# Altium schematic sheet SoM-Supply.SchDoc
size A3; DocumentNumber: 2; SheetNumber: 2; SheetTotal: 9; PageSetup: Record=PageOptions|CenterHorizontal=True|CenterVertical=True|PrintScale=0.97|XCorrection=1.00|YCorrection=1.00|PrintKind=1|BorderSize=5000000|LeftOffset=0|BottomOffset=0|Orientation=2|PaperLength=2970|PaperWidth=2100|Scale=100|PaperSource=7|PrintQuality=600|MediaType=1|DitherType=10|PaperKind=A4|PrintScaleMode=1
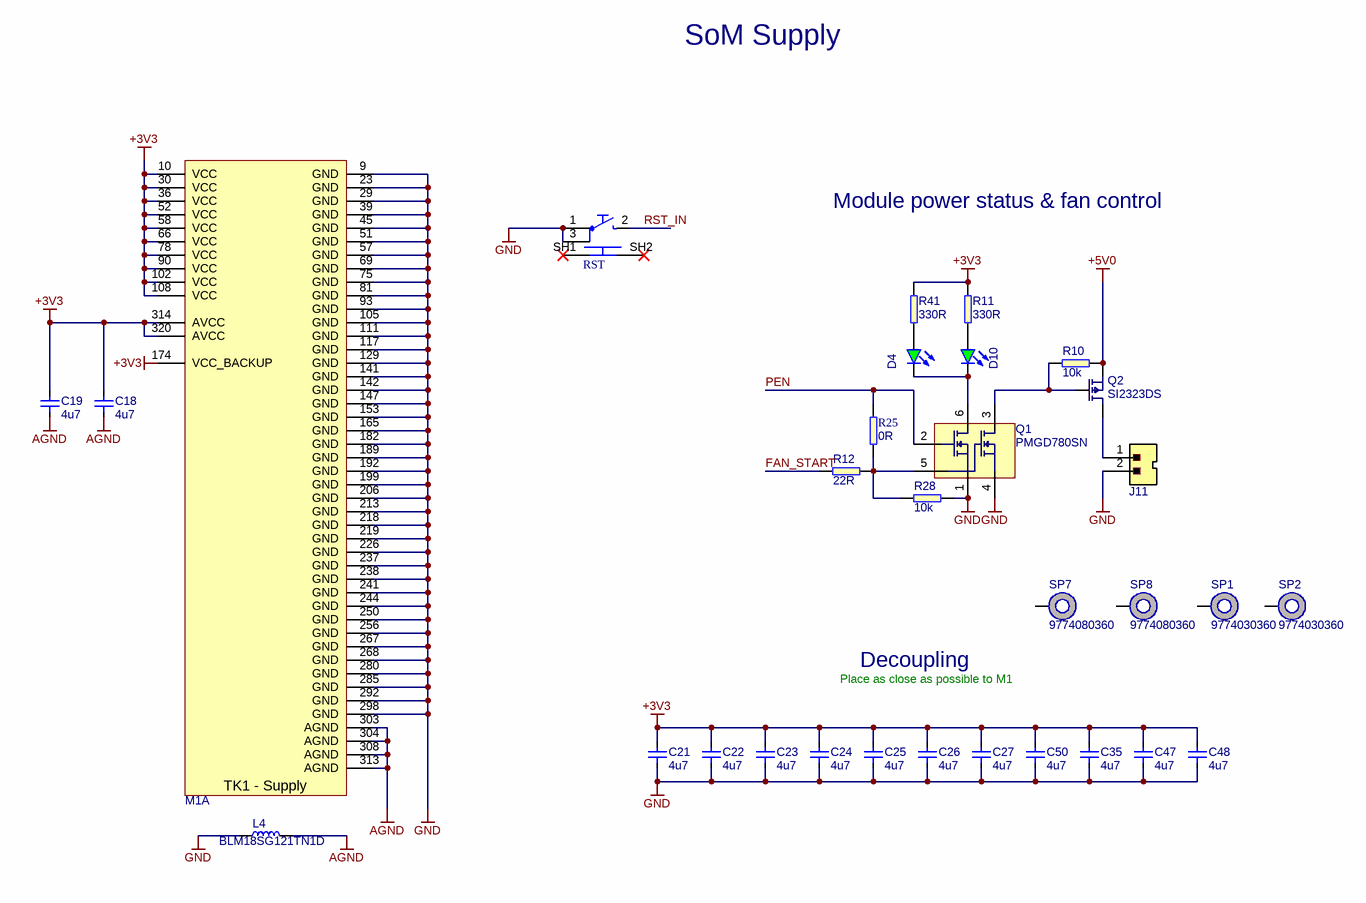
[diagram p0: SoM-Supply.SchDoc]

## Parts
C18  4u7  [0603]
C19  4u7  [0603]
C21  4u7  [0603]
C22  4u7  [0603]
C23  4u7  [0603]
C24  4u7  [0603]
C25  4u7  [0603]
C26  4u7  [0603]
C27  4u7  [0603]
C35  4u7  [0603]
C47  4u7  [0603]
C48  4u7  [0603]
C50  4u7  [0603]
D4  KPT-1608SGC  [LED0603]  (value not drawn)
D10  KPT-1608SGC  [LED0603]  (value not drawn)
J11  MX-22-23-2021  [molex_2223-2021]  (value not drawn)
L4  BLM18SG121TN1D  [0603]
M1  MM70-314-310B1  [Apalis-H]  (value not drawn)  (part A of 25)
Q1  PMGD780SN  [SOT-363]
Q2  SI2323DS  [SOT-23]
R10  10k  [0402]
R11  330R  [0402]
R12  22R  [0402]
R25  0R  [0402]
R28  10k  [0402]
R41  330R  [0402]
RST  TL3340AF160QG  [TL3340AF160QG]  (value not drawn)
SP1  9774030360  [M3-3mm]
SP2  9774030360  [M3-3mm]
SP7  9774080360  [M3-8mm]
SP8  9774080360  [M3-8mm]

## Nets
+3V3: C18.2 C19.2 C21.2 C22.2 C23.2 C24.2 C25.2 C26.2 C27.2 C35.2 C47.2 C48.2 C50.2 M1.10(VCC) M1.30(VCC) M1.36(VCC) M1.52(VCC) M1.58(VCC) M1.66(VCC) M1.78(VCC) M1.90(VCC) M1.102(VCC) M1.108(VCC) M1.174(VCC_BACKUP) M1.314(AVCC) M1.320(AVCC) R11.2 R41.2
+5V0: Q2.2(S) R10.2
AGND: C18.1 C19.1 L4.2 M1.303(AGND) M1.304(AGND) M1.308(AGND) M1.313(AGND)
GND: C21.1 C22.1 C23.1 C24.1 C25.1 C26.1 C27.1 C35.1 C47.1 C48.1 C50.1 J11.2 L4.1 M1.9(GND) M1.23(GND) M1.29(GND) M1.39(GND) M1.45(GND) M1.51(GND) M1.57(GND) M1.69(GND) M1.75(GND) M1.81(GND) M1.93(GND) M1.105(GND) M1.111(GND) M1.117(GND) M1.129(GND) M1.141(GND) M1.142(GND) M1.147(GND) M1.153(GND) M1.165(GND) M1.182(GND) M1.189(GND) M1.192(GND) M1.199(GND) M1.206(GND) M1.213(GND) M1.218(GND) M1.219(GND) M1.226(GND) M1.237(GND) M1.238(GND) M1.241(GND) M1.244(GND) M1.250(GND) M1.256(GND) M1.267(GND) M1.268(GND) M1.280(GND) M1.285(GND) M1.292(GND) M1.298(GND) Q1.1(S1) Q1.4(S2) R28.2 RST.1 RST.3
FAN_START: R12.1
PEN: Q1.2(G1) R25.2
RST_IN: RST.2
NetD4_A: D4.A R41.1
NetD4_K: D4.K D10.K Q1.6(D1)
NetD10_A: D10.A R11.1
NetJ11_1: J11.1 Q2.3(D)
NetQ1_3: Q1.3(D2) Q2.1(G) R10.1
NetQ1_5: Q1.5(G2) R12.2 R25.1 R28.1

Not connected (* = marked no-connect by the designer): RST SH1* SH2*; SP1 1; SP2 1; SP7 1; SP8 1

## Notes on the sheet
- SoM Supply
- Module power status & fan control
- Place as close as possible to M1
- Decoupling
- Title:
- Size:
- Date:
- A3
- Revision:
- Page:
- of
- Antmicro Ltd.
- File:
- www.antmicro.com
- (in symbol Apalis-TK1-H, part A) TK1 - Supply

## Library data of the parts
C18 C19 C21-C27 C35 C47 C48 C50 = C_4u7_0603: MLCC SMT Capacitor 4.7uF 0603; Manufacturer: MULTICOMP; Part Symbol: MC0603X475K6R3CT; Value: 4u7; Part Number: C_4u7_0603; MPN: MC0603X475K6R3CT
D4 D10 = LED_G: LED Green 0603 case; Manufacturer: KINGBRIGHT; Part Number: LED_G; Value: KPT-1608SGC; Part Symbol: KPT-1608SGC; MPN: KPT-1608SGC
J11 = molex_2223-2021: Pinhead connector with key; Manufacturer: Molex; Part Symbol: 022232021 A-6373-02A222; Part Number: molex_2223-2021; Value: MX-22-23-2021; MPN: 022232021 A-6373-02A222
L4 = BLM18SG121TN1D: FERRITE BEAD, 0.025OHM, 3A, 0603; Manufacturer: MURATA; Part Number: BLM18SG121TN1D; Value: BLM18SG121TN1D; Part Symbol: BLM18SG121TN1D; MPN: BLM18SG121TN1D
M1 = Apalis-TK1-H: Toradex Apalis TK1, Horizontal; Manufacturer: JAE Electronics; Part Number: Apalis-TK1-H; Part Symbol: MM70-314-310B1; Value: MM70-314-310B1; MPN: MM70-314-310B1
Q1 = PMGD780SN: 60 V, dual N-channel Trench MOSFET; Manufacturer: NXP; Part Symbol: PMGD780SN,115; Part Number: PMGD780SN; Value: PMGD780SN; MPN: PMGD780SN,115
Q2 = PMOS: pMOS 4.7A 20V; Manufacturer: Vishay; Part Symbol: SI2323DS-T1-E3; Part Number: SI2323DS; Value: SI2323DS; MPN: SI2323DS-T1-E3
R10 R28 = R_10k_0402: RES, 10k, 0402; Manufacturer: MULTICOMP; Part Symbol: MCMR04X1002FTL; Value: 10k; Part Number: R_10k_0402; MPN: MCMR04X1002FTL
R11 R41 = R_330R_0402: RES, 330R, 0402; Manufacturer: MULTICOMP; Part Symbol: MCMR04X3300FTL; Value: 330R; Part Number: R_330R_0402; MPN: MCMR04X3300FTL
R12 = R_22R_0402: RES, 22R, 0402; Manufacturer: VISHAY; Part Symbol: CRCW040222R0FKED; Value: 22R; Part Number: R_22R_0402; MPN: CRCW040222R0FKED
R25 = R_0R_0402: RES, 0R, 0402; Manufacturer: Panasonic; Part Symbol: ERJ2GE0R00X; Value: 0R; Part Number: R_0R_0402; MPN: ERJ2GE0R00X
RST = TL3340AF160QG: E-SWITCH  TL3340AF160QG  SWITCH, TACTILE SPST 50mA, SMD GULL WING; Part Number: TL3340AF160QG; Value: TL3340AF160QG; Manufacturer: E-SWITCH; Part Symbol: TL3340AF160QG; MPN: TL3340AF160QG
SP1 SP2 = WE_9774030360: M3x3; Manufacturer: WURTH ELEKTRONIK; Part Number: WE_9774030360; Value: 9774030360; Part Symbol: 9774030360; MPN: 9774030360
SP7 SP8 = M3x8: M2.5x5; Manufacturer: WURTH ELEKTRONIK; Part Number: 9774080360; Value: 9774080360; Part Symbol: 9774080360; MPN: 9774080360